# EAGLE schematic DAU_Kupplung.brd_V1_5 (EAGLE 5.11)
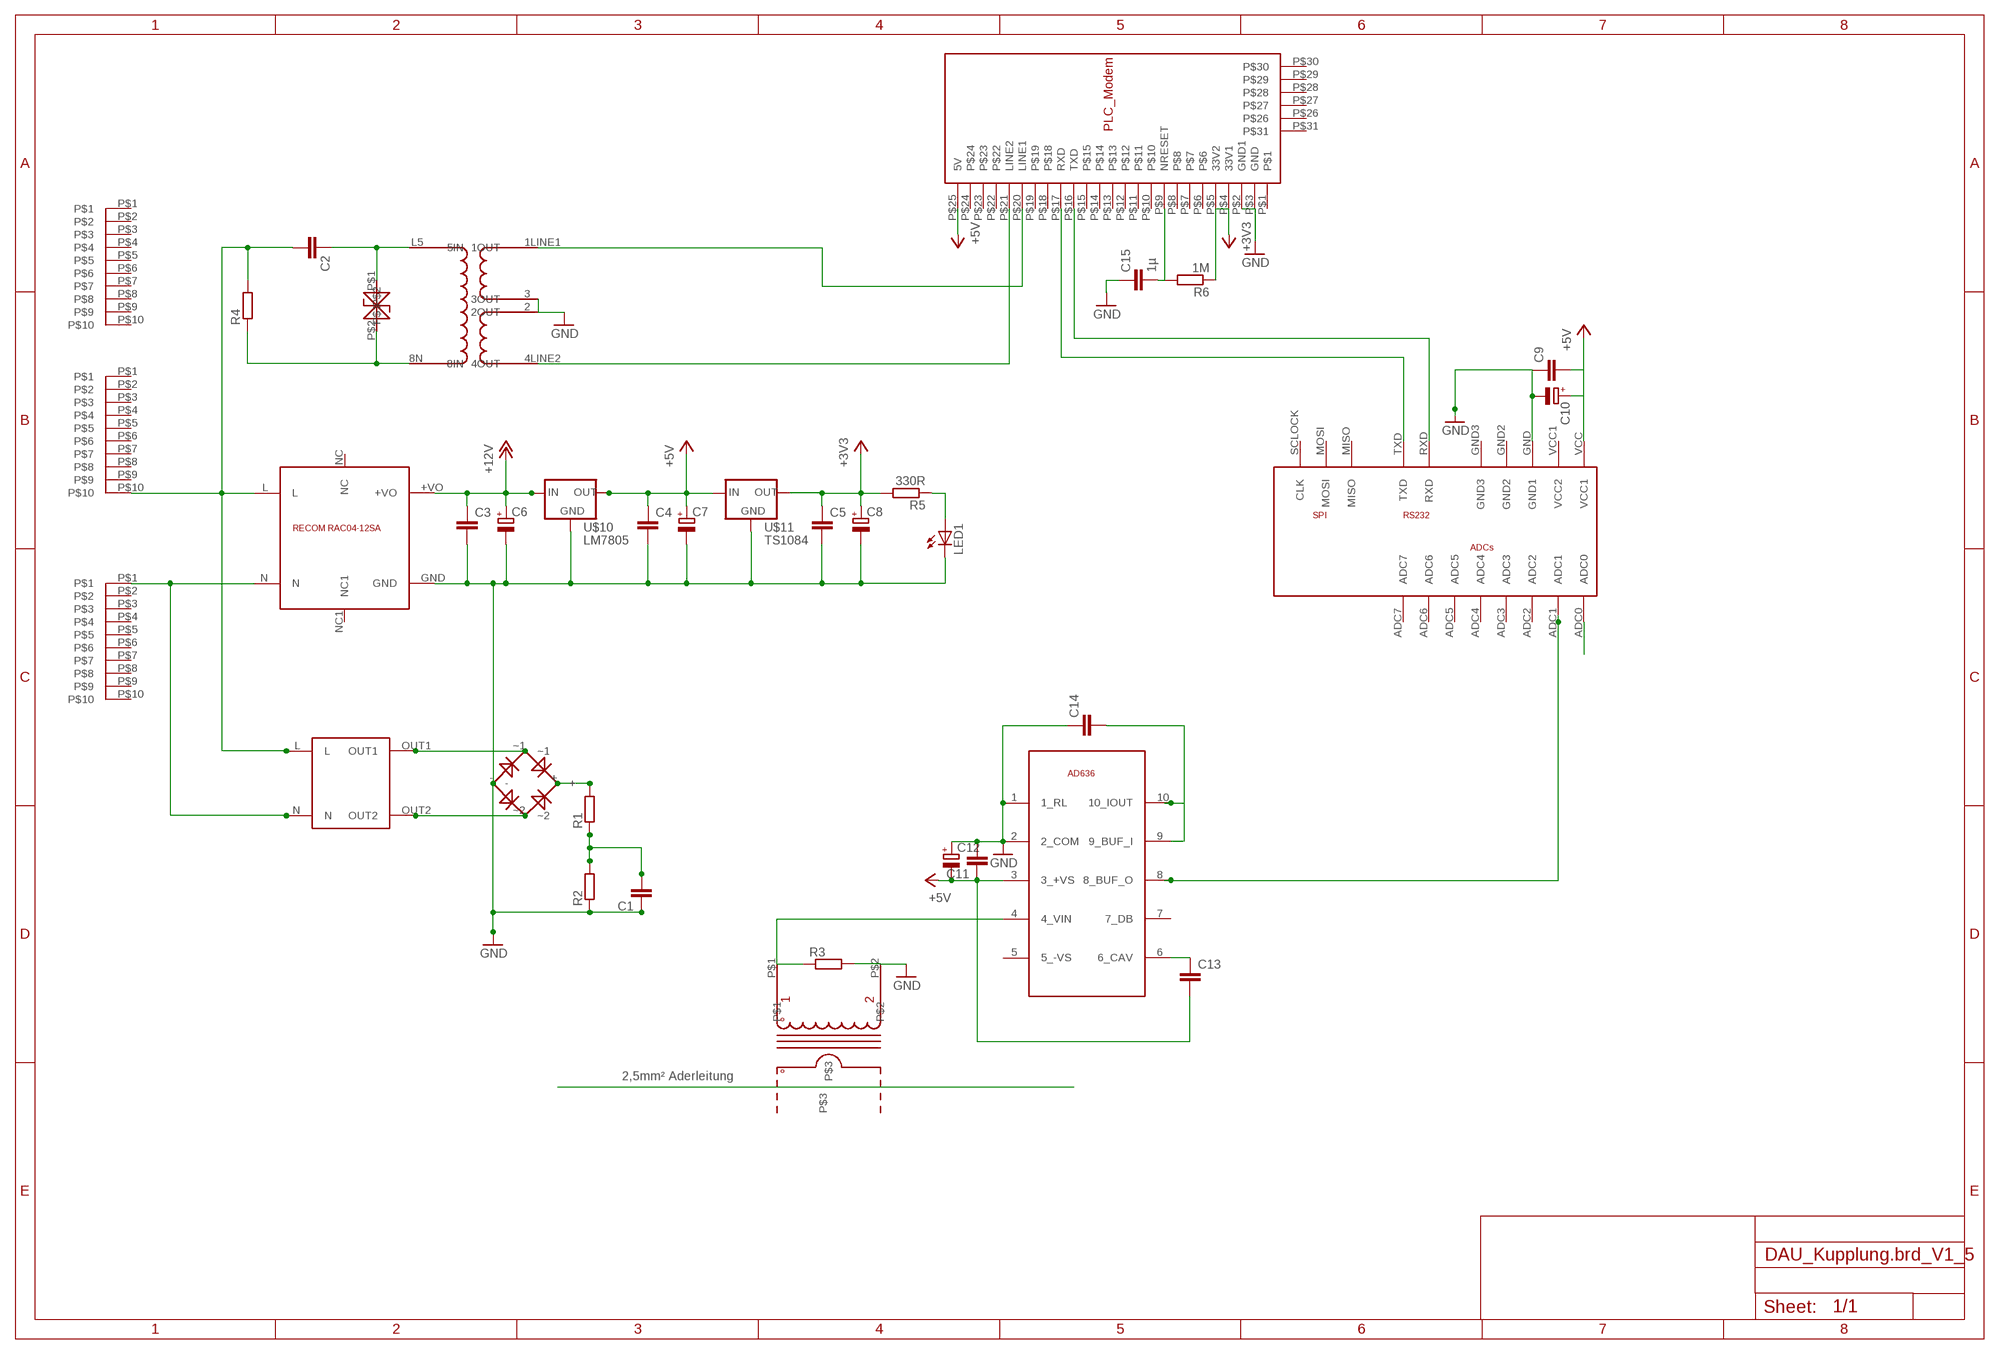
[diagram p0: schematic, sheet 1]

## Parts
C1  C2,5-3  [C2.5-3]
C2  C-EU225-087X268  [C225-087X268]
C3  C-EU025-040X050  [C025-040X050]
C4  C-EU025-040X050  [C025-040X050]
C5  C-EU025-040X050  [C025-040X050]
C6  CPOL-EUE2.5-6  [E2,5-6]
C7  CPOL-EUE2.5-6  [E2,5-6]
C8  CPOL-EUE2.5-6  [E2,5-6]
C9  C-EU025-040X050  [C025-040X050]
C10  CPOL-EUE2,5-6E  [E2,5-6E]
C11  C-EU025-040X050  [C025-040X050]
C12  CPOL-EUE2,5-6E  [E2,5-6E]
C13  C-EU025-040X050  [C025-040X050]
C14  C-EU025-040X050  [C025-040X050]
C15  1µ  C-EU025-040X050  [C025-040X050]
L  PRINT_CONNECTOR  [FASTON_DOUBLE]
LED1  LEDSQR2X5  [LED2X5]
N  PRINT_CONNECTOR  [FASTON_DOUBLE]
PE  PRINT_CONNECTOR  [FASTON_DOUBLE]
R1  R-EU_0204/7  [0204/7]
R2  R-EU_0204/7  [0204/7]
R3  R-EU_0204/7  [0204/7]
R4  R-EU_0204/7  [0204/7]
R5  330R  R-EU_0204/7  [0204/7]
R6  1M  R-EU_0204/7  [0204/7]
U$1  RECOM_RAC04_12SA  [RAC04_12SA]
U$2  SICHERHEITSTRAFO  [TRAFO_0,35VA]
U$3  ADUC831_MINIMUM  [ADUC_MINIMUM]
U$4  MODEMSTECKER  [MODEM_FUSS]
U$5  PLC_UEBERTRAGER_V2  [PLC-UEBERTRAGER_V2]
U$6  AC1010  [AC1010]
U$7  AD636  [TO100_10PIN]
U$8  RECTIFIER  [RECTIFIER]
U$9  SUPPRESSORDIODE15MM  [DIODE15_5MM]
U$10  LM7805  [LM7805]
U$11  TS1084  [TS1084]

## Nets
+3V3: C5.1 C8.+ R5.2 R6.1 U$4.P$4(33V1) U$4.P$5(33V2) U$11.2OUT(OUT)
+5V: C4.1 C7.+ C9.2 C10.+ C11.1 C12.- C13.2 U$3.VCC(VCC1) U$4.P$25(5V) U$7.3(3_+VS) U$10.OUT U$11.3IN(IN)
+12V: C3.1 C6.+ U$1.+VO U$10.IN
GND: C1.1 C3.2 C4.2 C5.2 C6.- C7.- C8.- C9.1 C10.- C11.2 C12.+ C14.1 C15.1 LED1.K(C) R2.1 R3.2 U$1.GND U$3.GND(GND1) U$4.P$2(GND1) U$4.P$3(GND) U$5.2(2OUT) U$5.3(3OUT) U$6.P$2 U$7.1(1_RL) U$7.2(2_COM) U$8.- U$10.GND U$11.1GND(GND)
N$2: R4.1 U$5.8N(8IN) U$9.P$2
N$3: U$2.OUT1 U$8.~1
N$4: U$2.OUT2 U$8.~2
N$5: U$4.P$20(LINE1) U$5.1LINE1(1OUT)
N$6: C1.2 R1.1 R2.2 U$3.ADC0
N$7: R1.2 U$8.+
N$8: R3.1 U$6.P$1 U$7.4(4_VIN)
N$10: N.P$1 U$1.N U$2.N
N$11: C2.1 U$5.L5(5IN) U$9.P$1
N$12: C2.2 L.P$10 R4.2 U$1.L U$2.L
N$13: U$4.P$21(LINE2) U$5.4LINE2(4OUT)
N$14: U$3.RXD U$4.P$16(TXD)
N$15: U$3.TXD U$4.P$17(RXD)
N$16: C14.2 U$7.9(9_BUF_I) U$7.10(10_IOUT)
N$17: C13.1 U$7.6(6_CAV)
N$18: U$3.ADC1 U$7.8(8_BUF_O)
N$19: LED1.A R5.1
N$20: C15.2 R6.2 U$4.P$9(NRESET)
Unconnected: L.P$1 L.P$2 L.P$3 L.P$4 L.P$5 L.P$6 L.P$7 L.P$8 L.P$9 N.P$2 N.P$3 N.P$4 N.P$5 N.P$6 N.P$7 N.P$8 N.P$9 N.P$10 PE.P$1 PE.P$2 PE.P$3 PE.P$4 PE.P$5 PE.P$6 PE.P$7 PE.P$8 PE.P$9 PE.P$10 U$1.NC U$1.NC1 U$3.ADC2 U$3.ADC3 U$3.ADC4 U$3.ADC5 U$3.ADC6 U$3.ADC7 U$3.GND2 U$3.GND3 U$3.MISO U$3.MOSI U$3.SCLOCK(CLK) U$3.VCC1(VCC2) U$4.P$1 U$4.P$6 U$4.P$7 U$4.P$8 U$4.P$10 U$4.P$11 U$4.P$12 U$4.P$13 U$4.P$14 U$4.P$15 U$4.P$18 U$4.P$19 U$4.P$22 U$4.P$23 U$4.P$24 U$4.P$26 U$4.P$27 U$4.P$28 U$4.P$29 U$4.P$30 U$4.P$31 U$6.P$3 U$7.5(5_-VS) U$7.7(7_DB)

## Notes on the sheet
- 2,5mm² Aderleitung

## Library data of the parts
C1 = capacitor-wima:C: CAPACITOR naming: grid - package width
C2-C5 C15 = resistor:C-EU: CAPACITOR, European symbol
C6-C8 = resistor:CPOL-EU: POLARIZED CAPACITOR, European symbol
C9 C11 C13 C14 = rcl:C-EU: CAPACITOR, European symbol
C10 C12 = rcl:CPOL-EU: POLARIZED CAPACITOR, European symbol
L N PE = ADS:PRINT_CONNECTOR
LED1 = led:LED: LED OSRAM: - CHIPLED LG R971, LG N971, LY N971, LG Q971, LY Q971, LO R971, LY R971 LH N974, LH R974 LS Q976, LO Q976, LY Q976 LO Q996 - Hyper CHIPLED LW Q18S LB Q993, LB Q99A, LB R99A - SideLED LS A670, LO A670, LY A670, LG A670, LP A670 LB A673, LV A673, LT A673, LW A673 LH A674 LY A675 LS A676, LA A676, LO A676, LY A676, LW A676 LS A679, LY A679, LG A679 - Hyper Micro SIDELED® LS Y876, LA Y876, LO Y876, LY Y876 LT Y87S - SmartLED LW L88C, LW L88S LB L89C, LB L89S, LG L890 LS L89K, LO L89K, LY L89K LS L896, LA L896, LO L896, LY L896 - TOPLED LS T670, LO T670, LY T670, LG T670, LP T670 LSG T670, LSP T670, LSY T670, LOP T670, LYG T670 LG T671, LOG T671, LSG T671 LB T673, LV T673, LT T673, LW T673 LH T674 LS T676, LA T676, LO T676, LY T676, LB T676, LH T676, LSB T676, LW T676 LB T67C, LV T67C, LT T67C, LS T67K, LO T67K, LY T67K, LW E67C LS E67B, LA E67B, LO E67B, LY E67B, LB E67C, LV E67C, LT E67C LW T67C LS T679, LY T679, LG T679 LS T770, LO T770, LY T770, LG T770, LP T770 LB T773, LV T773, LT T773, LW T773 LH T774 LS E675, LA E675, LY E675, LS T675 LS T776, LA T776, LO T776, LY T776, LB T776 LHGB T686 LT T68C, LB T68C - Hyper Mini TOPLED® LB M676 - Mini TOPLED Santana® LG M470 LS M47K, LO M47K, LY M47K Source: http://www.osram.convergy.de LUXEON: - LUMILED® LXK2-PW12-R00, LXK2-PW12-S00, LXK2-PW14-U00, LXK2-PW14-V00 LXK2-PM12-R00, LXK2-PM12-S00, LXK2-PM14-U00 LXK2-PE12-Q00, LXK2-PE12-R00, LXK2-PE12-S00, LXK2-PE14-T00, LXK2-PE14-U00 LXK2-PB12-K00, LXK2-PB12-L00, LXK2-PB12-M00, LXK2-PB14-N00, LXK2-PB14-P00, LXK2-PB14-Q00 LXK2-PR12-L00, LXK2-PR12-M00, LXK2-PR14-Q00, LXK2-PR14-R00 LXK2-PD12-Q00, LXK2-PD12-R00, LXK2-PD12-S00 LXK2-PH12-R00, LXK2-PH12-S00 LXK2-PL12-P00, LXK2-PL12-Q00, LXK2-PL12-R00 Source: www.luxeon.com KINGBRIGHT: KA-3528ASYC Source: www.kingbright.com
R1-R6 = resistor:R-EU_: RESISTOR, European symbol
U$1 = ADS:RECOM_RAC04_12SA
U$2 = ADS:SICHERHEITSTRAFO
U$3 = ADS_ADUCBoards:ADUC831_MINIMUM
U$4 = ADS:MODEMSTECKER
U$5 = ADS1:PLC_UEBERTRAGER_V2
U$6 = ADS:AC1010
U$7 = ADS:AD636
U$8 = ADS:RECTIFIER
U$9 = ADS:SUPPRESSORDIODE15MM
U$10 = ADS:LM7805
U$11 = ADS1:TS1084